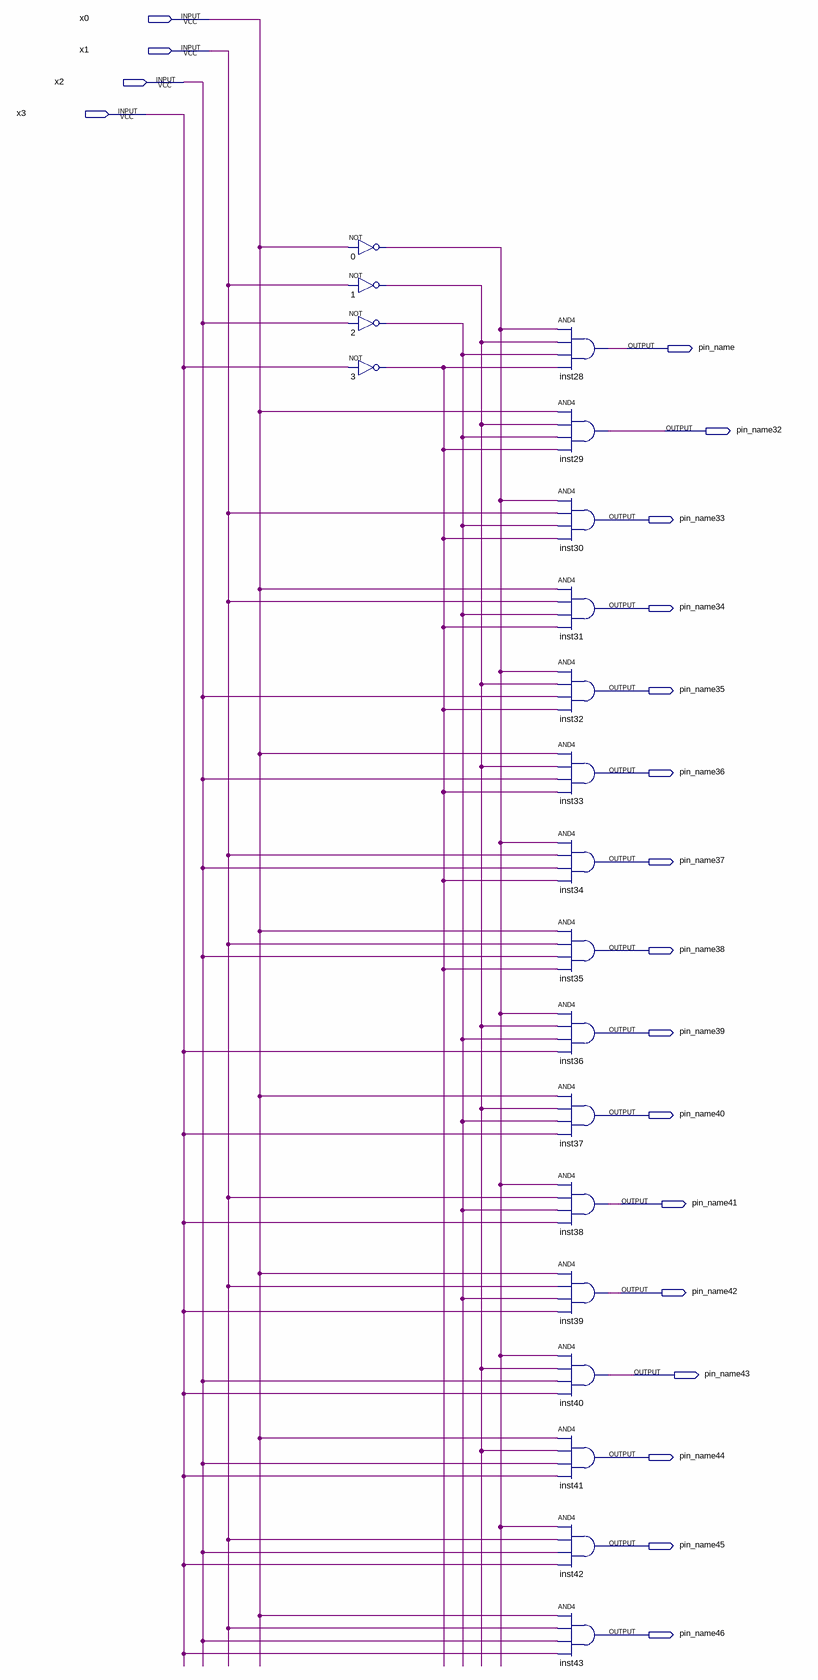
[diagram p0: schematic sheet]
// Quartus schematic decoder(4in16).bdf as structural Verilog: 20 symbols, 20 pins
module \decoder(4in16)  (
  input  x0,
  input  x1,
  input  x2,
  input  x3,
  output pin_name,
  output pin_name32,
  output pin_name33,
  output pin_name34,
  output pin_name35,
  output pin_name36,
  output pin_name37,
  output pin_name38,
  output pin_name39,
  output pin_name40,
  output pin_name41,
  output pin_name42,
  output pin_name43,
  output pin_name44,
  output pin_name45,
  output pin_name46
);

  wire n0_out, n1_out, n2_out, n3_out;

  not u_0 (n0_out, x0);
  not u_1 (n1_out, x1);
  not u_2 (n2_out, x2);
  not u_3 (n3_out, x3);
  and inst28 (pin_name, n0_out, n1_out, n2_out, n3_out);
  and inst29 (pin_name32, x0, n1_out, n2_out, n3_out);
  and inst30 (pin_name33, n0_out, x1, n2_out, n3_out);
  and inst31 (pin_name34, x0, x1, n2_out, n3_out);
  and inst32 (pin_name35, n0_out, n1_out, x2, n3_out);
  and inst33 (pin_name36, x0, n1_out, x2, n3_out);
  and inst34 (pin_name37, n0_out, x1, x2, n3_out);
  and inst35 (pin_name38, x0, x1, x2, n3_out);
  and inst36 (pin_name39, n0_out, n1_out, n2_out, x3);
  and inst37 (pin_name40, x0, n1_out, n2_out, x3);
  and inst38 (pin_name41, n0_out, x1, n2_out, x3);
  and inst39 (pin_name42, x0, x1, n2_out, x3);
  and inst40 (pin_name43, n0_out, n1_out, x2, x3);
  and inst41 (pin_name44, x0, n1_out, x2, x3);
  and inst42 (pin_name45, n0_out, x1, x2, x3);
  and inst43 (pin_name46, x0, x1, x2, x3);
endmodule
